# Altium schematic sheet main.SchDoc
size A4
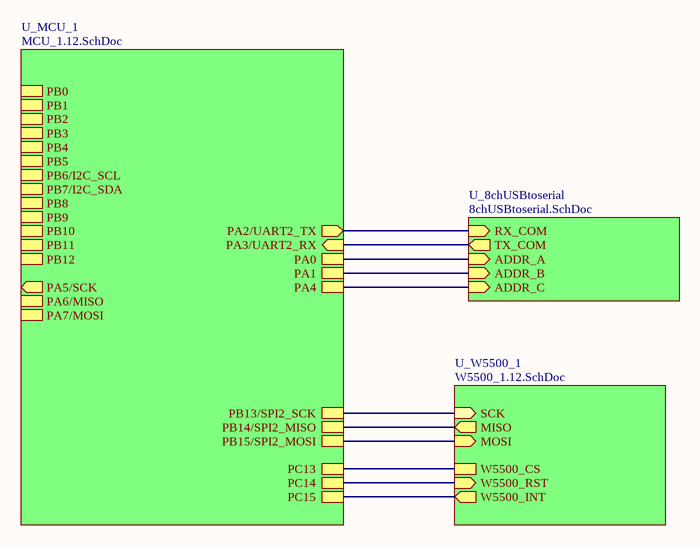
[diagram p0: main.SchDoc]

## Sub-sheets
U_8chUSBtoserial = 8chUSBtoserial.SchDoc: RX_COM (in), ADDR_A (in), ADDR_B (in), ADDR_C (in), TX_COM (out)
U_MCU_1 = MCU_1.12.SchDoc: PA7/MOSI, PA6/MISO, PA5/SCK (out), PB0, PB1, PB2, PB3, PB4, PB5, PB6/I2C_SCL, PB7/I2C_SDA, PB8, PB9, PB10, PB11, PB12, PB13/SPI2_SCK, PB14/SPI2_MISO, PB15/SPI2_MOSI, PA0, PA1, PA4, PC13, PC14, PC15, PA2/UART2_TX (out), PA3/UART2_RX (in)
U_W5500_1 = W5500_1.12.SchDoc: SCK (in), W5500_INT (out), W5500_CS, W5500_RST (in), MOSI (in), MISO (out)

## Nets
(unnamed): sheet U_8chUSBtoserial/RX_COM, sheet U_MCU_1/PA2/UART2_TX
(unnamed): sheet U_8chUSBtoserial/ADDR_A, sheet U_MCU_1/PA0
(unnamed): sheet U_8chUSBtoserial/ADDR_B, sheet U_MCU_1/PA1
(unnamed): sheet U_8chUSBtoserial/ADDR_C, sheet U_MCU_1/PA4
(unnamed): sheet U_8chUSBtoserial/TX_COM, sheet U_MCU_1/PA3/UART2_RX
(unnamed): sheet U_MCU_1/PB13/SPI2_SCK, sheet U_W5500_1/SCK
(unnamed): sheet U_MCU_1/PB14/SPI2_MISO, sheet U_W5500_1/MISO
(unnamed): sheet U_MCU_1/PB15/SPI2_MOSI, sheet U_W5500_1/MOSI
(unnamed): sheet U_MCU_1/PC13, sheet U_W5500_1/W5500_CS
(unnamed): sheet U_MCU_1/PC14, sheet U_W5500_1/W5500_RST
(unnamed): sheet U_MCU_1/PC15, sheet U_W5500_1/W5500_INT